# Altium project template.PrjPCB
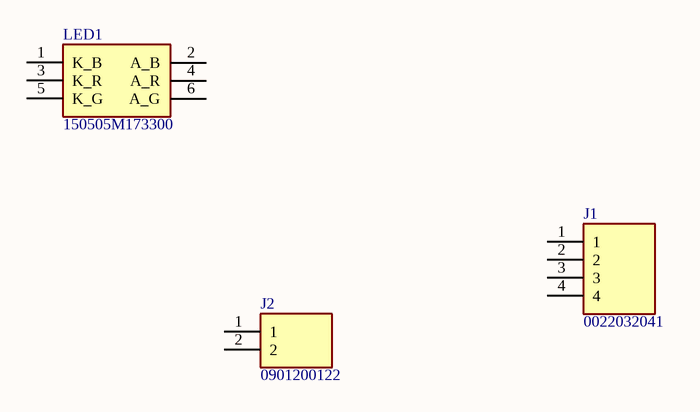
[diagram p0: Sheet1.SchDoc]
1 sheet, 3 parts. Net scope: global (net labels, ports and power ports of the same name join across sheets).
Board file: PCB_template.PcbDoc

## Sheet Sheet1.SchDoc
size A4

### Parts
J1  0022032041  [HDRV4W87P0X254_1X4_991X236X1155P]
J2  0901200122  [HDRV2W90P0X254_1X2_508X254X560P]
LED1  150505M173300  [150505M173300]

### Nets

Not connected (* = marked no-connect by the designer): J1 1 2 3 4; J2 1 2; LED1 1(K_B) 2(A_B) 3(K_R) 4(A_R) 5(K_G) 6(A_G)

### Library data of the parts
J1 = 0022032041: Connector; Manufacturer_Name: Molex; Datasheet Link: http://www.molex.com/pdm_docs/sd/022032041_sd.pdf; Height: 11.55mm; Manufacturer_Part_Number: 0022032041; Mouser Part Number: N/A; Mouser Price/Stock: https://www.mouser.com/Search/Refine.aspx?Keyword=N%2FA
J2 = 0901200122: Connector; Manufacturer_Name: Molex; Datasheet Link: http://www.molex.com/pdm_docs/sd/901200122_sd.pdf; Height: 5.6mm; Manufacturer_Part_Number: 0901200122; Mouser Part Number: N/A; Mouser Price/Stock: https://www.mouser.com/Search/Refine.aspx?Keyword=N%2FA
LED1 = 150505M173300: LED; Manufacturer_Name: Wurth Elektronik; Datasheet Link: https://katalog.we-online.de/led/datasheet/150505M173300.pdf; Height: 1.8mm; Manufacturer_Part_Number: 150505M173300; Mouser Part Number: 710-150505M173300; Mouser Price/Stock: https://www.mouser.com/Search/Refine.aspx?Keyword=710-150505M173300; RS Part Number: 1766248P; RS Price/Stock: http://uk.rs-online.com/web/p/products/1766248P